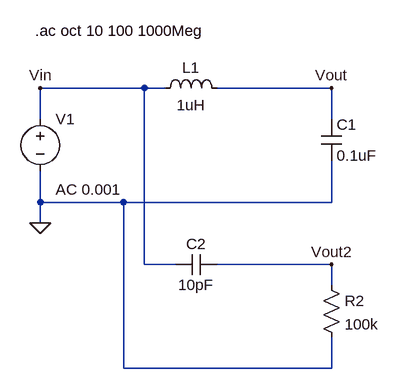
[diagram p0: schematic Filter_001.asc]
Filter_001.asc, the LTspice schematic file:
Version 4
SHEET 1 880 680
WIRE 176 -64 16 -64
WIRE 208 -64 176 -64
WIRE 464 -64 288 -64
WIRE 16 -16 16 -64
WIRE 464 -16 464 -64
WIRE 16 112 16 64
WIRE 144 112 16 112
WIRE 464 112 464 48
WIRE 464 112 144 112
WIRE 16 144 16 112
WIRE 176 208 176 -64
WIRE 224 208 176 208
WIRE 464 208 288 208
WIRE 464 240 464 208
WIRE 144 368 144 112
WIRE 464 368 464 320
WIRE 464 368 144 368
FLAG 16 144 0
FLAG 16 -64 Vin
FLAG 464 -64 Vout
FLAG 464 208 Vout2
SYMBOL ind 192 -48 R270
WINDOW 0 32 56 VTop 2
WINDOW 3 5 56 VBottom 2
SYMATTR InstName L1
SYMATTR Value 1uH
SYMATTR SpiceLine Ipk=2 Rser=0.062 Rpar=16900 Cpar=2.23p
SYMBOL voltage 16 -32 R0
WINDOW 123 24 124 Left 2
WINDOW 39 0 0 Left 0
SYMATTR Value2 AC 0.001
SYMATTR InstName V1
SYMATTR Value ""
SYMBOL cap 448 -16 R0
SYMATTR InstName C1
SYMATTR Value 0.1uF
SYMBOL cap 288 192 R90
WINDOW 0 0 32 VBottom 2
WINDOW 3 32 32 VTop 2
SYMATTR InstName C2
SYMATTR Value 10pF
SYMBOL res 448 224 R0
SYMATTR InstName R2
SYMATTR Value 100k
TEXT 8 -152 Left 2 !.ac oct 10 100 1000Meg

The netlist it stands for:
* Filter_001.asc
L1 Vin Vout 1uH Ipk=2 Rser=0.062 Rpar=16900 Cpar=2.23p
V1 Vin 0 AC 0.001
C1 Vout 0 0.1uF
C2 Vout2 Vin 10pF
R2 Vout2 0 100k
.ac oct 10 100 1000Meg
.backanno
.end

* Results of the author's LTspice run, read from the files saved beside the schematic
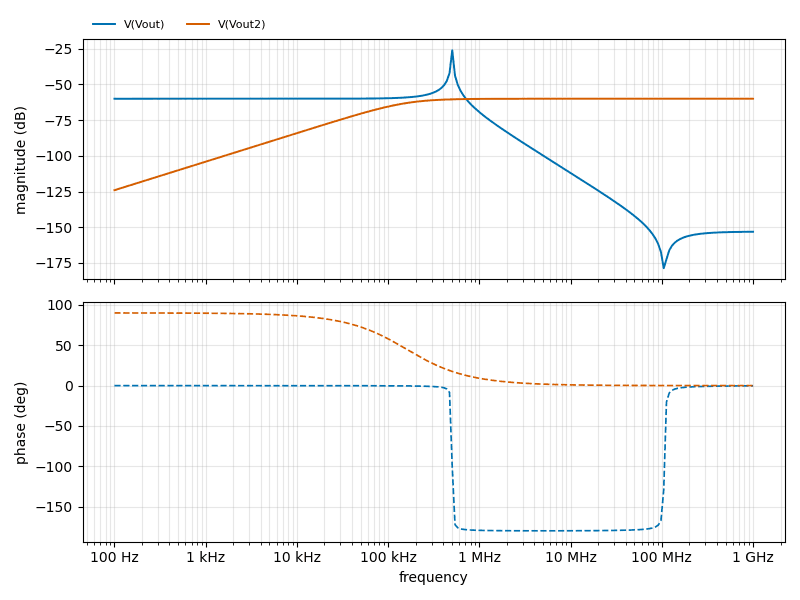
[diagram p1: AC Analysis of Filter_001.asc, plotted from the saved traces]
* AC Analysis, 1 run:
*   V(Vout): -60.00 dB at 100 Hz, -153.13 dB at 1 GHz, peak -26.12 dB at 504.3 kHz, 3 dB below the peak at 497.7 kHz and 510.3 kHz
*   V(Vout2): -124.04 dB at 100 Hz, -60.00 dB at 1 GHz, peak -60.00 dB at 1 GHz, 3 dB below the peak at 159.2 kHz